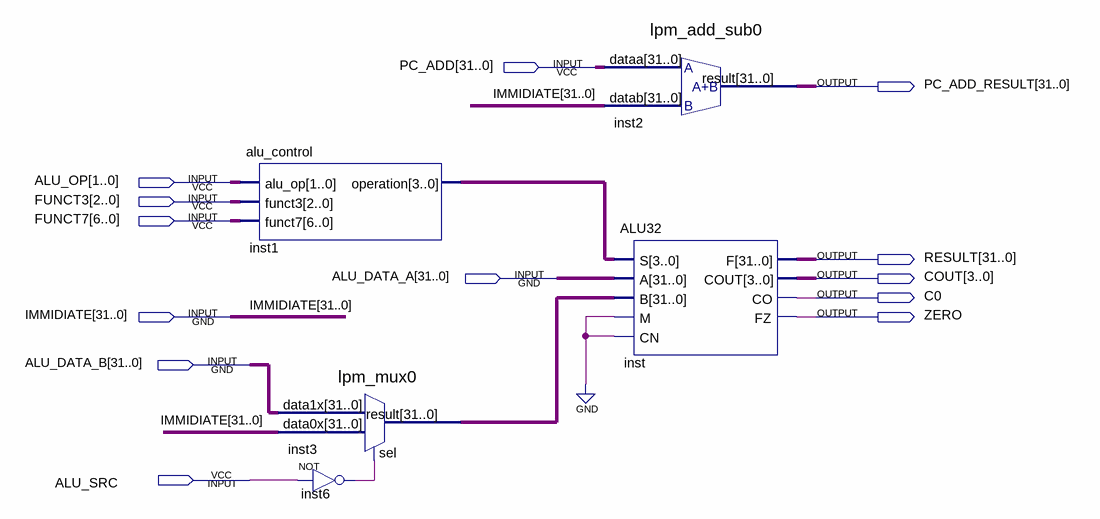
[diagram p0: schematic sheet]
// Quartus schematic EX.bdf as structural Verilog: 5 symbols, 13 pins
module EX (
  input  [31:0] PC_ADD,
  input  [1:0] ALU_OP,
  input  [2:0] FUNCT3,
  input  [6:0] FUNCT7,
  input  [31:0] ALU_DATA_A,
  input  [31:0] IMMIDIATE,
  input  [31:0] ALU_DATA_B,
  input  ALU_SRC,
  output [31:0] PC_ADD_RESULT,
  output [31:0] RESULT,
  output [3:0] COUT,
  output C0,
  output ZERO
);

  wire inst6_out;
  wire [3:0] inst1_operation;
  wire [31:0] inst3_result;

  alu_control inst1 (.alu_op(ALU_OP), .funct3(FUNCT3), .funct7(FUNCT7), .operation(inst1_operation));
  lpm_mux0 inst3 (.data1x(ALU_DATA_B), .data0x(IMMIDIATE), .sel(inst6_out), .result(inst3_result));
  not inst6 (inst6_out, ALU_SRC);
  lpm_add_sub0 inst2 (.dataa(PC_ADD), .datab(IMMIDIATE), .result(PC_ADD_RESULT));
  ALU32 inst (
    .S(inst1_operation), .A(ALU_DATA_A), .B(inst3_result), .M(1'b0), .CN(1'b0), .F(RESULT), .COUT(COUT),
    .CO(C0), .FZ(ZERO));
endmodule
